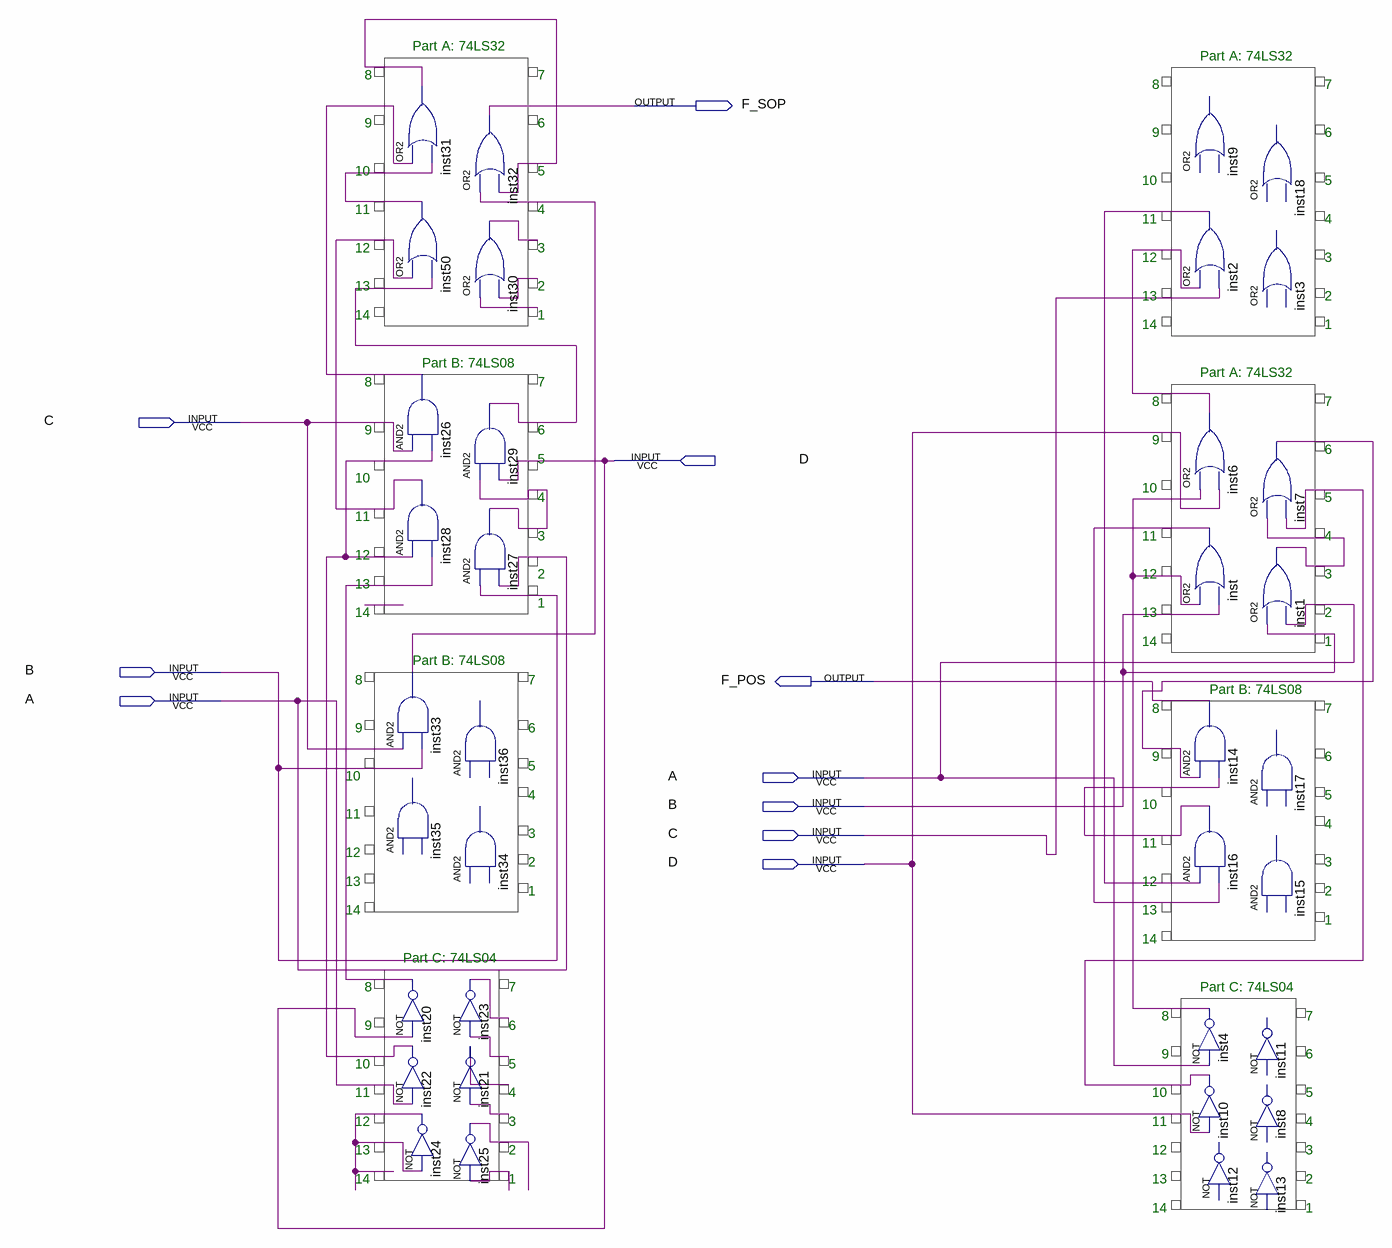
[diagram p0: schematic sheet]
// Quartus schematic smaller.bdf as structural Verilog: 36 symbols, 10 pins
module smaller (
  input  C,
  input  D,
  input  B,
  input  A,
  output F_SOP,
  output F_POS
);

  wire inst1_out, inst2_out, inst4_out, inst6_out, inst7_out, inst10_out, inst16_out, inst20_out, inst21_out,
       inst22_out, inst23_out, inst24_out, inst25_out, inst26_out, inst27_out, inst28_out, inst29_out,
       inst30_out, inst31_out, inst33_out, inst50_out, inst_out, undriven, undriven_2, undriven_3,
       undriven_4, undriven_5;

  or inst31 (inst31_out, inst26_out, inst50_out);
  or inst50 (inst50_out, inst28_out, inst29_out);
  and inst26 (inst26_out, C, inst22_out);
  and inst28 (inst28_out, inst22_out, inst20_out);
  and inst33 (inst33_out, C, B);
  // AND2 inst36 is placed but not wired
  // AND2 inst35 is placed but not wired
  // AND2 inst34 is placed but not wired
  not inst20 (inst20_out, D);
  not inst23 (inst23_out, undriven_3);
  not inst21 (inst21_out, undriven_4);
  not inst22 (inst22_out, A);
  not inst24 (inst24_out, inst24_out);
  not inst25 (inst25_out, undriven_5);
  or inst32 (F_SOP, inst33_out, inst31_out);
  or inst30 (inst30_out, undriven_2, undriven);
  and inst29 (inst29_out, inst27_out, D);
  and inst27 (inst27_out, B, A);
  // OR2 inst9 is placed but not wired
  or inst2 (inst2_out, inst6_out, C);
  or inst6 (inst6_out, inst4_out, D);
  or inst (inst_out, inst4_out, B);
  and inst14 (F_POS, inst7_out, inst16_out);
  and inst16 (inst16_out, inst2_out, inst_out);
  not inst4 (inst4_out, A);
  not inst10 (inst10_out, D);
  // NOT inst12 is placed but not wired
  // OR2 inst18 is placed but not wired
  // OR2 inst3 is placed but not wired
  or inst7 (inst7_out, inst1_out, inst10_out);
  or inst1 (inst1_out, B, A);
  // AND2 inst17 is placed but not wired
  // AND2 inst15 is placed but not wired
  // NOT inst11 is placed but not wired
  // NOT inst8 is placed but not wired
  // NOT inst13 is placed but not wired

  // Notes on the sheet:
  //   Part A: 74LS32
  //   Part A: 74LS32
  //   8
  //   7
  //   8
  //   7
  //   9
  //   6
  //   9
  //   6
  //   10
  //   5
  //   10
  //   5
  //   11
  //   4
  //   11
  //   4
  //   12
  //   3
  //   12
  //   3
  //   13
  //   2
  //   13
  //   2
  //   14
  //   1
  //   14
  //   1
  //   Part B: 74LS08
  //   Part A: 74LS32
  //   8
  //   7
  //   8
  //   7
  //   9
  //   6
  //   9
  //   6
  //   5
  //   10
  //   10
  //   4
  //   5
  //   11
  //   3
  //   11
  //   4
  //   12
  //   2
  //   12
  //   3
  //   13
  //   1
  //   14
  //   13
  //   2
  //   14
  //   1
  //   Part B: 74LS08
  //   8
  //   7
  //   Part B: 74LS08
  //   8
  //   7
  //   9
  //   6
  //   9
  //   6
  //   5
  //   10
  //   4
  //   5
  //   10
  //   11
  //   4
  //   3
  //   11
  //   12
  //   2
  //   3
  //   13
  //   12
  //   1
  //   2
  //   14
  //   13
  //   1
  //   14
  //   Part C: 74LS04
  //   8
  //   7
  //   Part C: 74LS04
  //   8
  //   7
  //   9
  //   6
  //   9
  //   6
  //   10
  //   5
  //   11
  //   4
  //   10
  //   5
  //   12
  //   3
  //   11
  //   4
  //   13
  //   2
  //   12
  //   3
  //   14
  //   1
  //   13
  //   2
  //   14
  //   1
endmodule
